# Altium schematic sheet [CC2538] Power Diagram.SchDoc
size 254 x 208 mm; Date: 10/04/2024; DrawnBy: TinhChau; Revision: 1; SheetNumber: 1; SheetTotal: 4
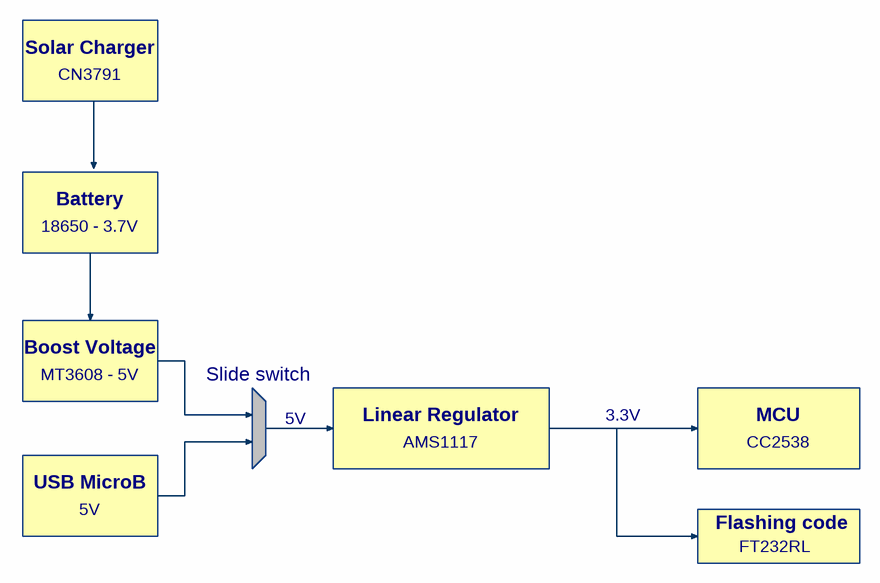
[diagram p0: [CC2538] Power Diagram.SchDoc]

## Notes on the sheet
- Solar Charger
- CN3791
- Battery
- 18650 - 3.7V
- Boost Voltage
- MT3608 - 5V
- Slide switch
- 5V
- Linear Regulator
- 3.3V
- MCU
- USB MicroB
- AMS1117
- CC2538
- FT232RL
- Flashing code
- Title
- Size
- Date:
- A4
- Number
- Check by:
- Revision
- Sheet of:
- Draw by: